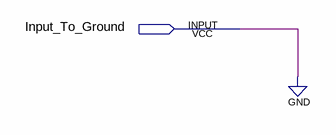
[diagram p0: schematic sheet]
// Quartus schematic Grounder.bdf as structural Verilog: 0 symbols, 1 pins
module Grounder (
  input  Input_To_Ground
);

  // also tied to GND on the sheet: Input_To_Ground
endmodule
